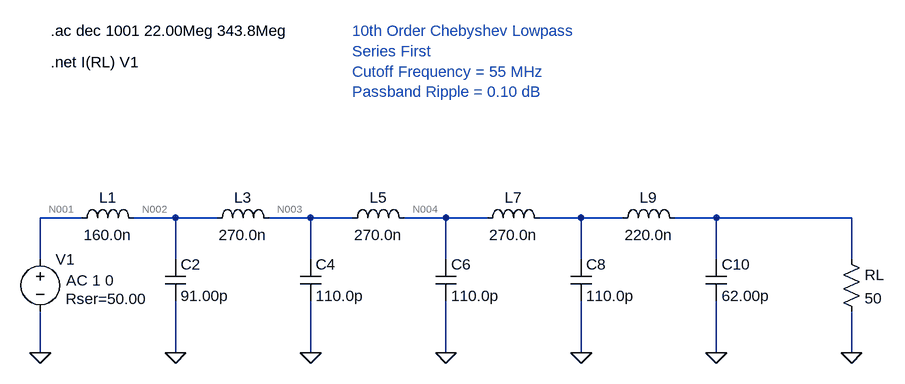
[diagram p0: schematic lowpassfilter.asc]
lowpassfilter.asc, the LTspice schematic file:
Version 4
SHEET 1 1304 400
WIRE 64 0 0 0
WIRE 208 0 144 0
WIRE 272 0 208 0
WIRE 416 0 352 0
WIRE 480 0 416 0
WIRE 624 0 560 0
WIRE 688 0 624 0
WIRE 832 0 768 0
WIRE 896 0 832 0
WIRE 1040 0 976 0
WIRE 1248 0 1040 0
WIRE 0 64 0 0
WIRE 208 64 208 0
WIRE 416 64 416 0
WIRE 624 64 624 0
WIRE 832 64 832 0
WIRE 1040 64 1040 0
WIRE 1248 64 1248 0
WIRE 0 208 0 144
WIRE 208 208 208 128
WIRE 416 208 416 128
WIRE 624 208 624 128
WIRE 832 208 832 128
WIRE 1040 208 1040 128
WIRE 1248 208 1248 144
FLAG 0 208 0
FLAG 208 208 0
FLAG 416 208 0
FLAG 624 208 0
FLAG 832 208 0
FLAG 1040 208 0
FLAG 1248 208 0
SYMBOL voltage 0 48 R0
WINDOW 123 40 48 Left 2
WINDOW 39 39 77 Left 2
SYMATTR Value2 AC 1 0
SYMATTR SpiceLine Rser=50.00
SYMATTR InstName V1
SYMATTR Value ""
SYMBOL ind 48 16 R270
WINDOW 0 32 56 VTop 2
WINDOW 3 5 56 VBottom 2
SYMATTR InstName L1
SYMATTR Value 160.0n
SYMBOL cap 192 64 R0
SYMATTR InstName C2
SYMATTR Value 91.00p
SYMBOL ind 256 16 R270
WINDOW 0 32 56 VTop 2
WINDOW 3 5 56 VBottom 2
SYMATTR InstName L3
SYMATTR Value 270.0n
SYMBOL cap 400 64 R0
SYMATTR InstName C4
SYMATTR Value 110.0p
SYMBOL ind 464 16 R270
WINDOW 0 32 56 VTop 2
WINDOW 3 5 56 VBottom 2
SYMATTR InstName L5
SYMATTR Value 270.0n
SYMBOL cap 608 64 R0
SYMATTR InstName C6
SYMATTR Value 110.0p
SYMBOL ind 672 16 R270
WINDOW 0 32 56 VTop 2
WINDOW 3 5 56 VBottom 2
SYMATTR InstName L7
SYMATTR Value 270.0n
SYMBOL cap 816 64 R0
SYMATTR InstName C8
SYMATTR Value 110.0p
SYMBOL ind 880 16 R270
WINDOW 0 32 56 VTop 2
WINDOW 3 5 56 VBottom 2
SYMATTR InstName L9
SYMATTR Value 220.0n
SYMBOL cap 1024 64 R0
SYMATTR InstName C10
SYMATTR Value 62.00p
SYMBOL res 1232 48 R0
SYMATTR InstName RL
SYMATTR Value 50
TEXT 16 -288 Left 2 !.ac dec 1001 22.00Meg 343.8Meg
TEXT 16 -240 Left 2 !.net I(RL) V1
TEXT 480 -288 Left 2 ;10th Order Chebyshev Lowpass\nSeries First\nCutoff Frequency = 55 MHz\nPassband Ripple = 0.10 dB

The netlist it stands for:
* lowpassfilter.asc
V1 N001 0 AC 1 0 Rser=50.00
L1 N001 N002 160.0n
C2 N002 0 91.00p
L3 N002 N003 270.0n
C4 N003 0 110.0p
L5 N003 N004 270.0n
C6 N004 0 110.0p
L7 N004 N005 270.0n
C8 N005 0 110.0p
L9 N005 N006 220.0n
C10 N006 0 62.00p
RL N006 0 50
.ac dec 1001 22.00Meg 343.8Meg
.net I(RL) V1
* 10th Order Chebyshev Lowpass
* Series First
* Cutoff Frequency = 55 MHz
* Passband Ripple = 0.10 dB
.backanno
.end

* Results of the author's LTspice run, read from the files saved beside the schematic
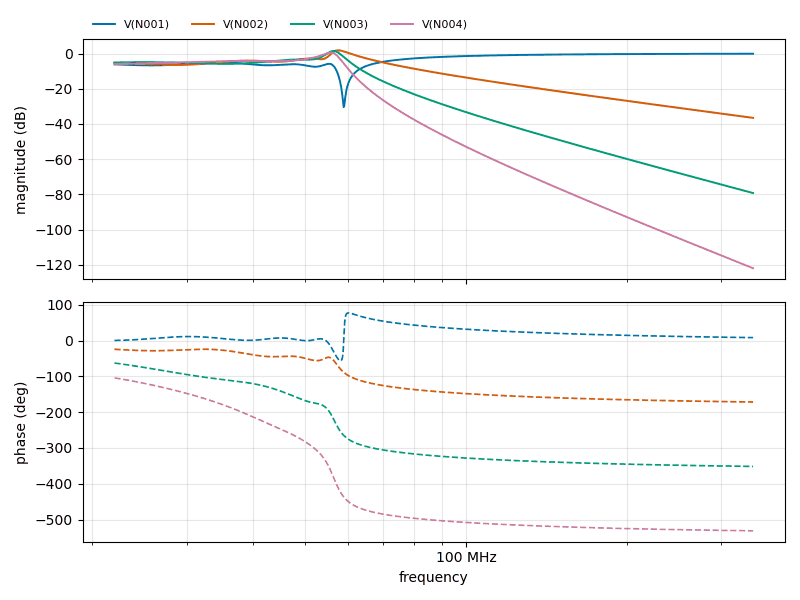
[diagram p1: AC Analysis of lowpassfilter.asc, plotted from the saved traces]
* AC Analysis, 1 run:
*   V(N001): -6.15 dB at 22 MHz, -0.09 dB at 343.8 MHz, peak -0.09 dB at 343.8 MHz, 3 dB below the peak at 77.2 MHz
*   V(N002): -5.38 dB at 22 MHz, -36.53 dB at 343.8 MHz, peak 1.83 dB at 57.68 MHz, 3 dB below the peak at 55.42 MHz and 62.38 MHz
*   V(N003): -5.06 dB at 22 MHz, -79.24 dB at 343.8 MHz, peak 1.45 dB at 56.5 MHz, 3 dB below the peak at 53.93 MHz and 58.82 MHz
*   V(N004): -5.94 dB at 22 MHz, -121.94 dB at 343.8 MHz, peak 0.52 dB at 55.85 MHz, 3 dB below the peak at 51.51 MHz and 57.88 MHz